# EAGLE design EURO_MIXER_2 (EAGLE 9.5.1)
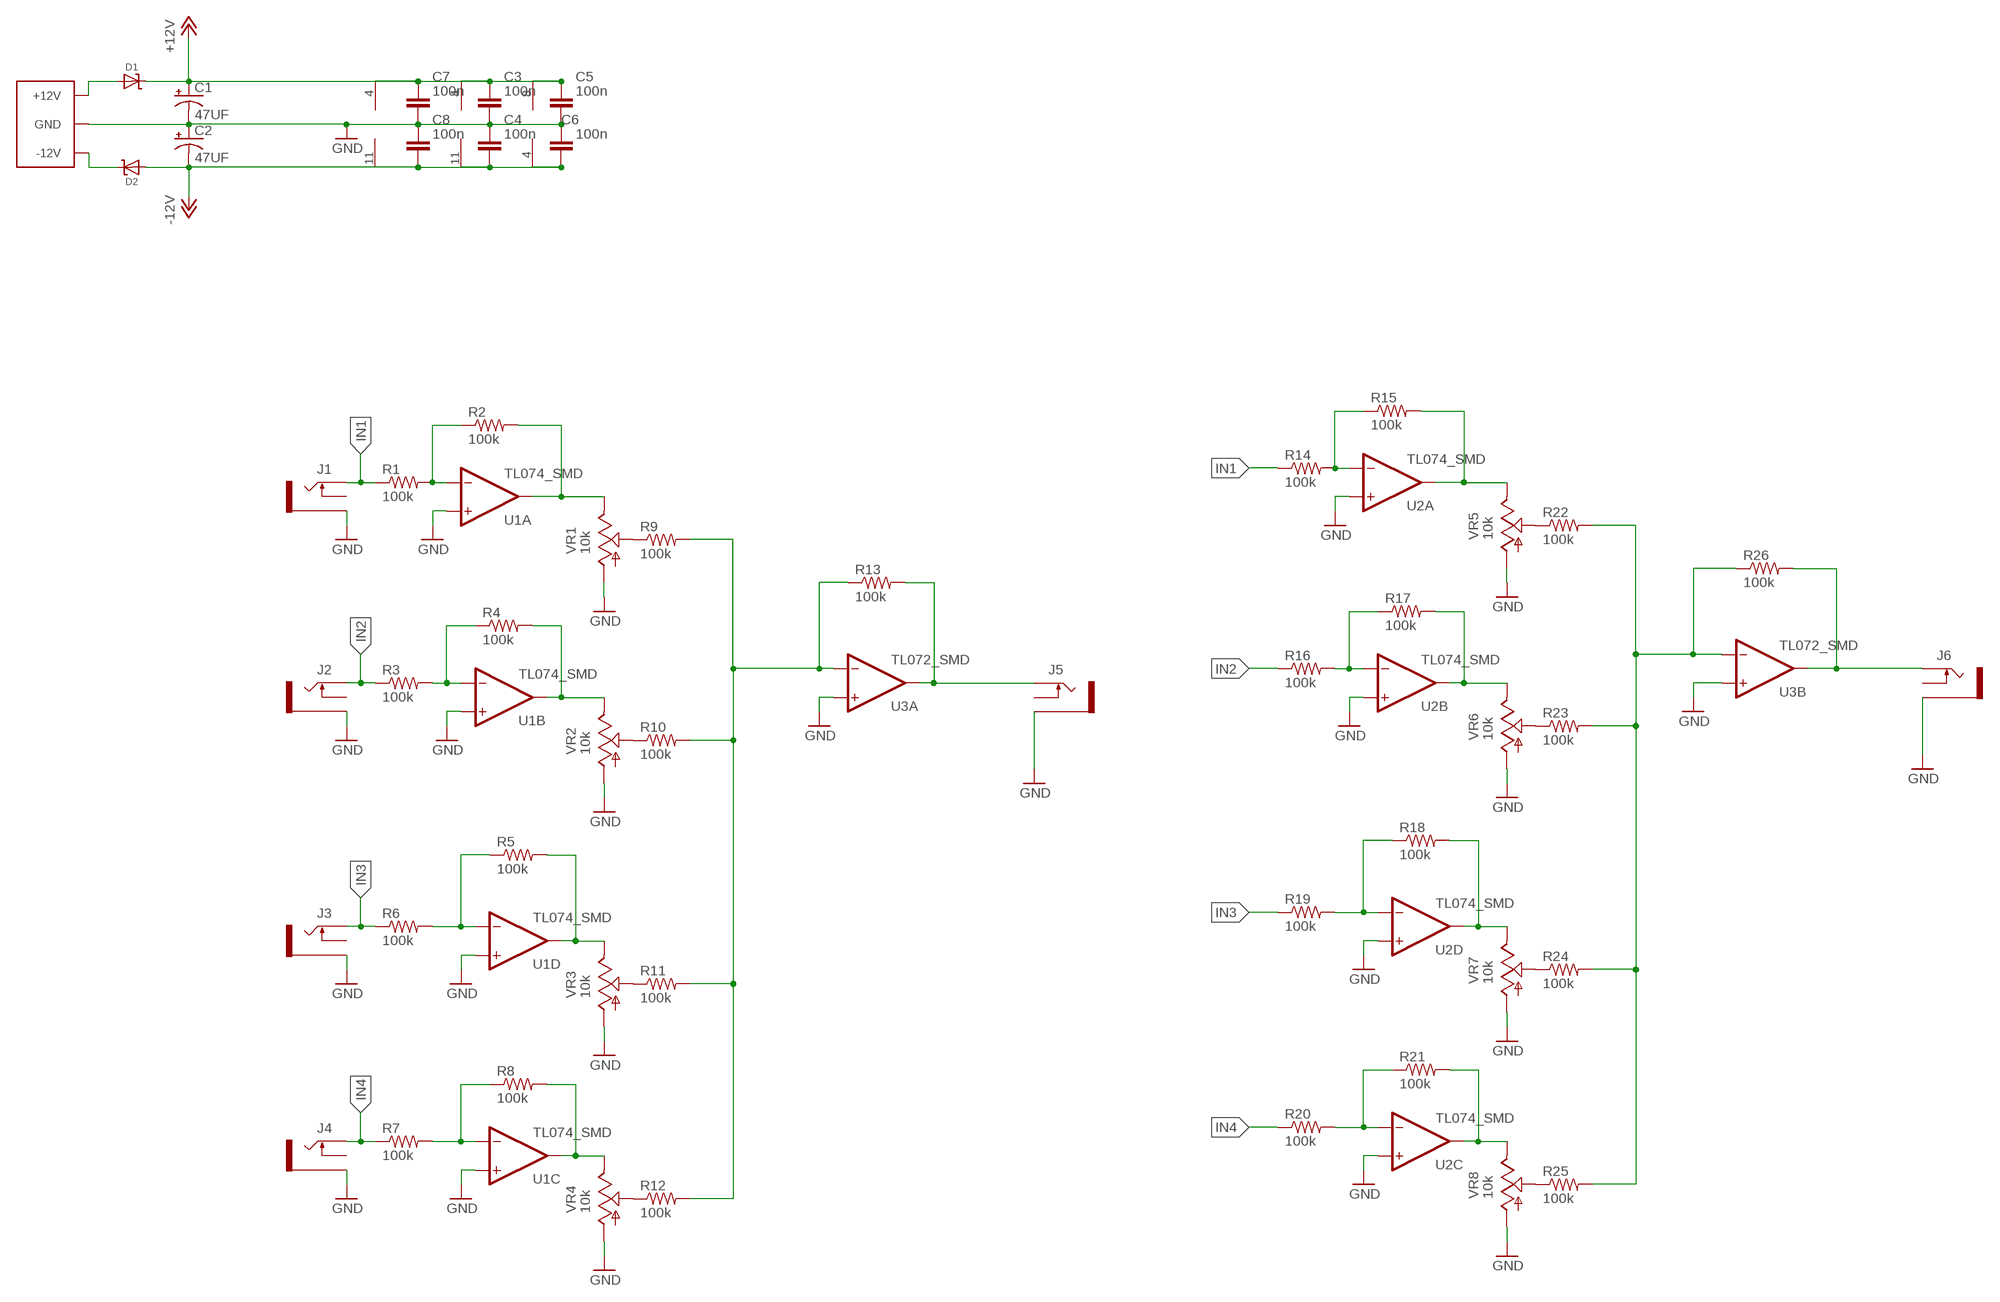
[diagram p0: schematic, sheet 1]

## Parts
C1  47UF  47UF-POLAR-PANASONIC_D-50V-20%  [PANASONIC_D]
C2  47UF  47UF-POLAR-PANASONIC_D-50V-20%  [PANASONIC_D]
C3  100n  C_CHIP-0805(2012-METRIC)  [CAPC2012X110]
C4  100n  C_CHIP-0805(2012-METRIC)  [CAPC2012X110]
C5  100n  C_CHIP-0805(2012-METRIC)  [CAPC2012X110]
C6  100n  C_CHIP-0805(2012-METRIC)  [CAPC2012X110]
C7  100n  C_CHIP-0805(2012-METRIC)  [CAPC2012X110]
C8  100n  C_CHIP-0805(2012-METRIC)  [CAPC2012X110]
D1  DIODE-SCHOTTKYSOD-123  [SOD-123]
D2  DIODE-SCHOTTKYSOD-123  [SOD-123]
J1  THONKICONNNEW  [WQP-PJ301M-12_JACK]
J2  THONKICONNNEW  [WQP-PJ301M-12_JACK]
J3  THONKICONNNEW  [WQP-PJ301M-12_JACK]
J4  THONKICONNNEW  [WQP-PJ301M-12_JACK]
J5  THONKICONNNEW  [WQP-PJ301M-12_JACK]
J6  THONKICONNNEW  [WQP-PJ301M-12_JACK]
JP1  EURO_POWER_LOCKSKINNY  [EURO_POWER_HEADER]
R1  100k  R-US_CHIP-0805(2012-METRIC)  [RESC2012X65]
R2  100k  R-US_CHIP-0805(2012-METRIC)  [RESC2012X65]
R3  100k  R-US_CHIP-0805(2012-METRIC)  [RESC2012X65]
R4  100k  R-US_CHIP-0805(2012-METRIC)  [RESC2012X65]
R5  100k  R-US_CHIP-0805(2012-METRIC)  [RESC2012X65]
R6  100k  R-US_CHIP-0805(2012-METRIC)  [RESC2012X65]
R7  100k  R-US_CHIP-0805(2012-METRIC)  [RESC2012X65]
R8  100k  R-US_CHIP-0805(2012-METRIC)  [RESC2012X65]
R9  100k  R-US_CHIP-0805(2012-METRIC)  [RESC2012X65]
R10  100k  R-US_CHIP-0805(2012-METRIC)  [RESC2012X65]
R11  100k  R-US_CHIP-0805(2012-METRIC)  [RESC2012X65]
R12  100k  R-US_CHIP-0805(2012-METRIC)  [RESC2012X65]
R13  100k  R-US_CHIP-0805(2012-METRIC)  [RESC2012X65]
R14  100k  R-US_CHIP-0805(2012-METRIC)  [RESC2012X65]
R15  100k  R-US_CHIP-0805(2012-METRIC)  [RESC2012X65]
R16  100k  R-US_CHIP-0805(2012-METRIC)  [RESC2012X65]
R17  100k  R-US_CHIP-0805(2012-METRIC)  [RESC2012X65]
R18  100k  R-US_CHIP-0805(2012-METRIC)  [RESC2012X65]
R19  100k  R-US_CHIP-0805(2012-METRIC)  [RESC2012X65]
R20  100k  R-US_CHIP-0805(2012-METRIC)  [RESC2012X65]
R21  100k  R-US_CHIP-0805(2012-METRIC)  [RESC2012X65]
R22  100k  R-US_CHIP-0805(2012-METRIC)  [RESC2012X65]
R23  100k  R-US_CHIP-0805(2012-METRIC)  [RESC2012X65]
R24  100k  R-US_CHIP-0805(2012-METRIC)  [RESC2012X65]
R25  100k  R-US_CHIP-0805(2012-METRIC)  [RESC2012X65]
R26  100k  R-US_CHIP-0805(2012-METRIC)  [RESC2012X65]
U1  TL074_SMD  [SO14]
U2  TL074_SMD  [SO14]
U3  TL072_SMD  [SO08]
VR1  10k  9MM_SNAP-IN_POT_  [9MM_SNAP-IN_POT]
VR2  10k  9MM_SNAP-IN_POT_  [9MM_SNAP-IN_POT]
VR3  10k  9MM_SNAP-IN_POT_  [9MM_SNAP-IN_POT]
VR4  10k  9MM_SNAP-IN_POT_  [9MM_SNAP-IN_POT]
VR5  10k  9MM_SNAP-IN_POT_  [9MM_SNAP-IN_POT]
VR6  10k  9MM_SNAP-IN_POT_  [9MM_SNAP-IN_POT]
VR7  10k  9MM_SNAP-IN_POT_  [9MM_SNAP-IN_POT]
VR8  10k  9MM_SNAP-IN_POT_  [9MM_SNAP-IN_POT]

## Nets
+12V: C1.+ C3.1 C5.1 C7.1 D1.C U1.4(P:V+) U2.4(P:V+) U3.8(P:V+)
-12V: C2.- C4.2 C6.2 C8.2 D2.A U1.11(P:V-) U2.11(P:V-) U3.4(P:V-)
GND: C1.- C2.+ C3.2 C4.1 C5.2 C6.1 C7.2 C8.1 J1.P$3_SLEEVE(SLEEVE) J2.P$3_SLEEVE(SLEEVE) J3.P$3_SLEEVE(SLEEVE) J4.P$3_SLEEVE(SLEEVE) J5.P$3_SLEEVE(SLEEVE) J6.P$3_SLEEVE(SLEEVE) JP1.3(GND) JP1.4(GND) JP1.5(GND) JP1.6(GND) JP1.7(GND) JP1.8(GND) U1.3(A:+IN) U1.5(B:+IN) U1.10(C:+IN) U1.12(D:+IN) U2.3(A:+IN) U2.5(B:+IN) U2.10(C:+IN) U2.12(D:+IN) U3.3(A:+IN) U3.5(B:+IN) VR1.1(A) VR2.1(A) VR3.1(A) VR4.1(A) VR5.1(A) VR6.1(A) VR7.1(A) VR8.1(A)
IN1: J1.P$1_TIP(TIP) R1.1 R14.1
IN2: J2.P$1_TIP(TIP) R3.1 R16.1
IN3: J3.P$1_TIP(TIP) R6.1 R19.1
IN4: J4.P$1_TIP(TIP) R7.1 R20.1
N$1: J6.P$1_TIP(TIP) R26.2 U3.7(B:OUT)
N$2: R1.2 R2.1 U1.2(A:-IN)
N$3: R2.2 U1.1(A:OUT) VR1.3(E)
N$4: D1.A JP1.9(+12V) JP1.10(+12V)
N$6: R7.2 R8.1 U1.9(C:-IN)
N$7: R4.2 U1.7(B:OUT) VR2.3(E)
N$8: R3.2 R4.1 U1.6(B:-IN)
N$10: R5.2 U1.14(D:OUT) VR3.3(E)
N$11: R14.2 R15.1 U2.2(A:-IN)
N$12: R9.1 VR1.2(S)
N$13: R8.2 U1.8(C:OUT) VR4.3(E)
N$14: R10.1 VR2.2(S)
N$15: R11.1 VR3.2(S)
N$16: R12.1 VR4.2(S)
N$17: R9.2 R10.2 R11.2 R12.2 R13.1 U3.2(A:-IN)
N$18: R5.1 R6.2 U1.13(D:-IN)
N$19: J5.P$1_TIP(TIP) R13.2 U3.1(A:OUT)
N$20: R15.2 U2.1(A:OUT) VR5.3(E)
N$21: R17.2 U2.7(B:OUT) VR6.3(E)
N$22: R18.2 U2.14(D:OUT) VR7.3(E)
N$23: R21.2 U2.8(C:OUT) VR8.3(E)
N$24: R22.1 VR5.2(S)
N$25: R23.1 VR6.2(S)
N$26: R24.1 VR7.2(S)
N$27: R25.1 VR8.2(S)
N$28: R22.2 R23.2 R24.2 R25.2 R26.1 U3.6(B:-IN)
N$29: R18.1 R19.2 U2.13(D:-IN)
N$30: R16.2 R17.1 U2.6(B:-IN)
N$31: R20.2 R21.1 U2.9(C:-IN)
N$32: D2.C JP1.1(-12V) JP1.2(-12V)
Unconnected: J1.P$2_SWITCH(SWITCH) J2.P$2_SWITCH(SWITCH) J3.P$2_SWITCH(SWITCH) J4.P$2_SWITCH(SWITCH) J5.P$2_SWITCH(SWITCH) J6.P$2_SWITCH(SWITCH)

## Library data of the parts
C1 C2 = SparkFun-Capacitors:47UF-POLAR: 47µF polarized capacitors A capacitor is a passive two-terminal electrical component used to store electrical energy temporarily in an electric field.
C3-C8 = Capacitor:C: Capacitor - Generic; CATEGORY: Capacitor
D1 D2 = Airquality_Sensor:DIODE-SCHOTTKY
J1-J6 = MusicThingModular:THONKICONN: 3.5mm socket for Eurorack modular synths
JP1 = MusicThingModular:EURO_POWER_LOCK
R1-R26 = Resistor:R-US: Resistor Fixed - ANSI; CATEGORY: Resistor; SUB-CATEGORY: Fixed
U1 U2 = MusicThingModular:TL074: Generic Quad Op Amp
U3 = MusicThingModular:TL072: Generic Dual Op Amp
VR1-VR8 = MusicThingModular:9MM_SNAP-IN_POT: 9mm vertical snap-in pot, Alpha / Panasonic style

## Net classes
0 default: width 0.305 mm, drill 0.508 mm, clearance 0.254 mm

## Board
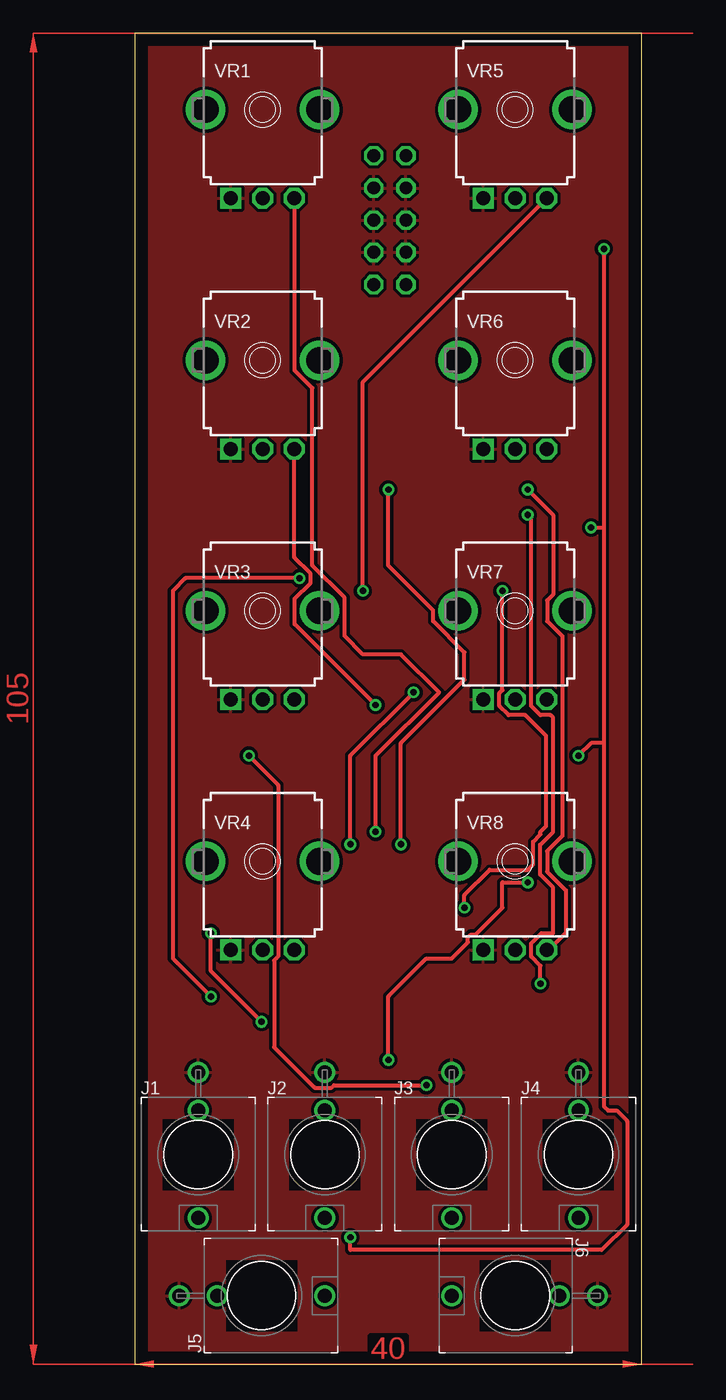
[diagram p1: board, top side]
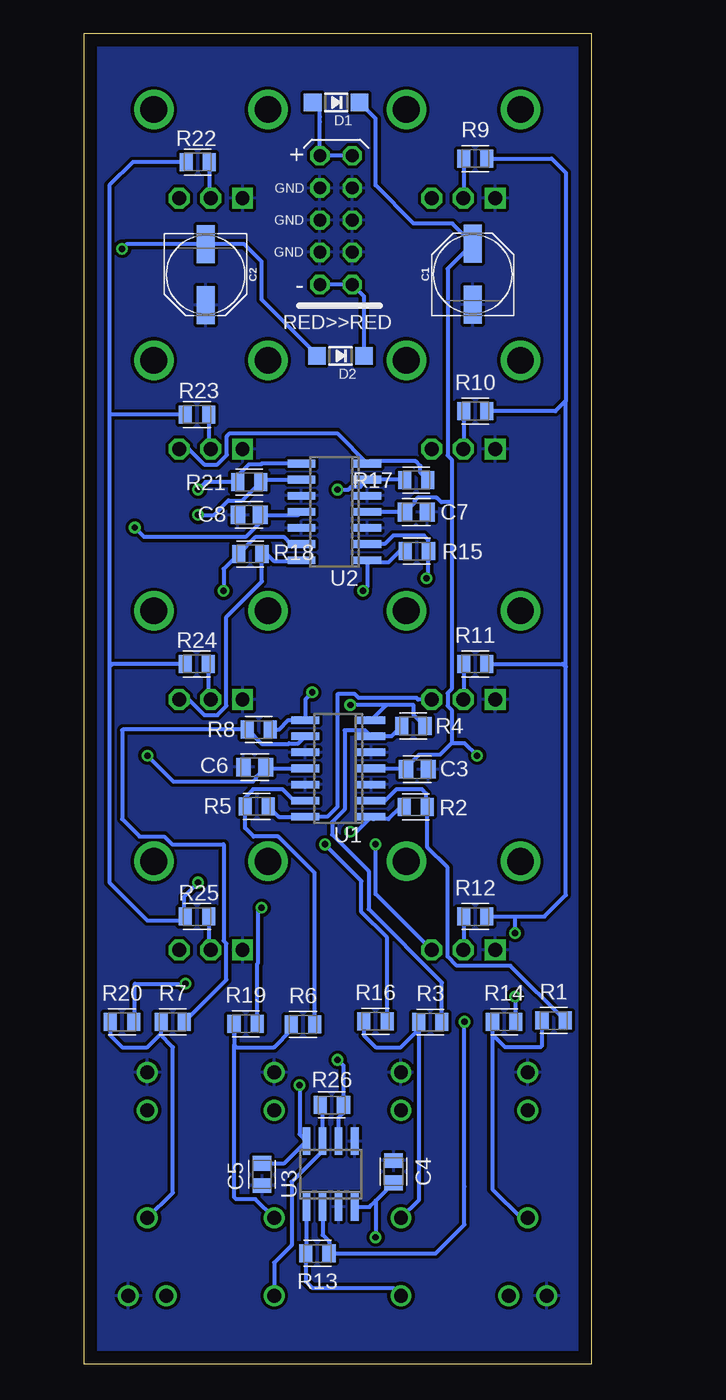
[diagram p2: board, bottom side, seen from below]

Size 40 x 105 mm. Coordinates in mm from the lower left corner, seen from the top.
Outline: 0,0 40,0 40,105 0,105 0,0
Copper layers (1*16): Top 0.035mm / dielectric 1.5mm / Bottom 0.035mm
Design rules "default": minimum track width 6mil, minimum drill 0.35mm, track to track 6mil, track to pad 6mil, pad to pad 6mil, via to via 6mil, smd to smd 6mil, copper to edge 40mil, drill to drill 6mil, minimum pad ring 10mil, minimum via ring 8mil, stop-mask expansion 4mil, vias tented up to drill 0mil, thermal gap 10mil

### Footprints (pad centres in the part's own frame; a part is rotated, then mirrored left to right if it is on the bottom)
PANASONIC_D = smd 3 x 1.4: + 2.4,0; - -2.4,0
CAPC2012X110 = smd 1.165 x 1.465: 1 -0.875,0; 2 0.875,0
SOD-123 = smd 1.4 x 1.4: A 1.85,0; C -1.85,0
WQP-PJ301M-12_JACK = drill 1.1: P$1_TIP 0,5; P$2_SWITCH 0,-3.5; P$3_SLEEVE 0,-6.5
EURO_POWER_HEADER = drill 1.016 octagon: 1 -5.08,-1.27; 2 -5.08,1.27; 3 -2.54,-1.27; 4 -2.54,1.27; 5 0,-1.27; 6 0,1.27; 7 2.54,-1.27; 8 2.54,1.27; 9 5.08,-1.27; 10 5.08,1.27
RESC2012X65 = smd 1.031 x 1.42: 1 -0.919,0; 2 0.919,0
SO14 = smd 0.6 x 2.2: 1 -3.81,-2.6; 2 -2.54,-2.6; 3 -1.27,-2.6; 4 0,-2.6; 5 1.27,-2.6; 6 2.54,-2.6; 7 3.81,-2.6; 8 3.81,2.6; 9 2.54,2.6; 10 1.27,2.6; 11 0,2.6; 12 -1.27,2.6; 13 -2.54,2.6; 14 -3.81,2.6
SO08 = smd 0.6 x 2.2: 1 -1.905,-2.6; 2 -0.635,-2.6; 3 0.635,-2.6; 4 1.905,-2.6; 5 1.905,2.6; 6 0.635,2.6; 7 -0.635,2.6; 8 -1.905,2.6
9MM_SNAP-IN_POT = drill 1.1 square: 1 -2.5,-7 | drill 1.1 octagon: 2 0,-7; 3 2.5,-7 | drill 2.1 pad 2.794: CHASSIS1 -4.5,0; CHASSIS2 4.5,0

### Placement (x,y rotation side)
C1  9.34,85.99 90 bottom
C2  30.41,85.96 270 bottom
C3  13.72,46.93 0 bottom
C4  15.58,15.18 270 bottom
C5  25.95,14.96 270 bottom
C6  26.55,47.1 0 bottom
C7  13.81,67.22 0 bottom
C8  26.98,67 0 bottom
D1  20.12,99.55 180 bottom
D2  19.77,79.55 180 bottom
J1  5,16.52 180 top
J2  15,16.52 180 top
J3  25,16.52 180 top
J4  35,16.52 180 top
J5  10,5.4 270 top
J6  30,5.4 90 top
JP1  20.12,90.26 90 bottom
R1  2.96,27.1 0 bottom
R2  13.84,43.97 180 bottom
R3  12.69,26.98 0 bottom
R4  14.03,50.34 0 bottom
R5  26.38,44.01 0 bottom
R6  22.73,26.8 0 bottom
R7  33,27 0 bottom
R8  26.22,50.06 0 bottom
R9  9.14,95.12 0 bottom
R10  9.14,75.18 0 bottom
R11  9.14,55.24 0 bottom
R12  9.14,35.31 0 bottom
R13  21.6,8.72 180 bottom
R14  6.87,27.01 0 bottom
R15  13.75,64.14 180 bottom
R16  17.02,27.05 0 bottom
R17  13.8,69.75 0 bottom
R18  26.89,63.93 0 bottom
R19  27.25,26.85 0 bottom
R20  37,27 0 bottom
R21  26.97,69.59 180 bottom
R22  31.04,94.84 180 bottom
R23  31.08,74.93 180 bottom
R24  31.11,55.24 180 bottom
R25  31.08,35.31 180 bottom
R26  20.45,20.44 180 bottom
U1  19.95,46.99 90 bottom
U2  20.25,67.24 90 bottom
U3  20.55,14.99 0 bottom
VR1  10.08,98.98 0 top
VR2  10.08,79.21 0 top
VR3  10.08,59.43 0 top
VR4  10.08,39.66 0 top
VR5  30,98.98 0 top
VR6  30,79.21 0 top
VR7  30,59.43 0 top
VR8  30,39.66 0 top

### Tracks (layer width: path | path; a pad name or v marks a point on that pad's centre or on a via)
+12V  (via drill 0.51)
  Top 0.305: v9,48 11.31,45.69 11.31,32.15 11,31.84 11,25 14.21,21.79 15.51,21.79 15.72,22 v23,22
  Bottom 0.305: D1.C 17,98.28 17,93 14,90 10.95,90 C1.+ 11.31,86.42 11.31,71.7 11,71.39 11,68 | C5.1 24.21,15.84 U3.8 23,18.14 v23,22 | U1.4 14.54,46.99 C3.1 14.6,47.07 13.6,48.07 11.93,48.07 11,49 | U2.4 17.63,67.22 C7.1 13.92,67.98 13.92,68.12 13.69,68.36 12.19,68.36 11.82,68 11,68 | 11,68 11,53.26 11.31,52.94 11.31,51.92 11,51.61 11,49 | 11,49 10,49 v9,48
-12V  (via drill 0.51)
  Top 0.305: v37,88 37,66 | 37,66 37,49 | 37,49 37,20.34 37.34,20 38,20 38.83,19.17 38.83,11 36.83,9 17,9 v17,10 | v36,66 37,66 | 37,49 36,49 v35,48
  Bottom 0.305: D2.A 21.62,79.62 26,84 26,87 27.36,88.36 C2.- 36.64,88.36 v37,88 | U3.4 17.5,12.39 17,12.89 | 17,12.89 C4.2 | U1.11 25.57,47 C6.2 26.44,46.34 26.44,46.2 26.68,45.96 32.96,45.96 v35,48 | U2.11 23.09,67 C8.2 26.11,66.41 27.26,65.26 35.26,65.26 v36,66 | 17,12.89 v17,10
GND
  pour Bottom: -4,111 43,111 43,-3 -5,-3 -5,111
  pour Top: -5,-3 43,-3 43,111 -5,111
IN1
  Bottom 0.305: R14.1 7.79,26 | 7.79,26 7.79,13.78 5.52,11.52 J1.P$1_TIP | R1.1 3.88,25.12 4,25 6.79,25 7.79,26
IN2
  Bottom 0.305: R16.1 17.94,25.94 17,25 15,25 13.61,26.39 R3.1 13.61,12.91 J2.P$1_TIP
IN3
  Bottom 0.305: R19.1 28.17,26 28.17,25.17 | 28.17,25.17 28,25 25,25 23.65,26.35 R6.1 | J3.P$1_TIP 26.48,13 28,13 28.17,13.17 28.17,25.17
IN4
  Bottom 0.305: R20.1 37.92,25.92 37,25 35,25 34,26 | 34,26 33.92,26.08 R7.1 | J4.P$1_TIP 33,13.52 33,25 34,26
N$1
  Bottom 0.305: R26.2 21.18,20.25 U3.7 21.18,16.82 23.62,14.38 23.62,9.38 25,8 J6.P$1_TIP
N$2
  Bottom 0.305: U1.2 16.26,44.45 15.37,45.34 13.34,45.34 13,45 13,44.05 R2.1 12.92,40.78 11.31,39.17 11.31,32.15 10.59,31.43 6.37,31.43 R1.2
N$3  (via drill 0.51)
  Top 0.305: v19,42 19,48 24,53 21,56 18,56 16.55,57.45 16.55,60.47 14,63.01 14,77.01 12.62,78.39 12.62,91.94 VR1.3
  Bottom 0.305: R2.2 15.03,43.97 16,43 17.17,43 U1.1 18.53,42 v19,42
N$4
  Bottom 0.305: JP1.9 JP1.10 21.39,98 21.39,98.39 21.39,98.97 D1.A
N$6
  Bottom 0.305: U1.9 23.11,48.97 23.82,48.97 23.84,48.94 25.98,48.94 27.1,50.06 R8.1 36.94,50.06 37,50 37,43 35.62,41.62 33.69,41.62 33.06,41 29,41 29,33.4 28.77,33.17 28.77,30.31 R7.2
N$7  (via drill 0.51)
  Top 0.305: VR2.3 12.58,63.64 13.86,62.36 13.86,61.64 12.62,60.4 12.62,58.38 v19,52
  Bottom 0.305: R4.2 14,51.23 14,52 16.15,52 | 16.15,52 U1.7 | 16.15,52 v19,52
N$8
  Bottom 0.305: R4.1 15.75,49.53 U1.6 17.82,50 19.44,50 19.44,43.77 20.44,42.77 20.44,41.78 17.56,38.9 17.56,35.9 11.77,30.11 R3.2
N$10
  Bottom 0.305: R5.2 24.63,43.18 U1.14 20.82,43.18 20,44 20,52.86 18.64,52.86 18.34,52.56 13.77,52.56 13.64,52.43 VR3.3
N$11  (via drill 0.51)
  Top 0.305: v13,62 4,62 3,61 3,32 v6,29
  Bottom 0.305: U2.2 16.3,64.7 15.61,65.39 13.19,65.39 12.83,65.03 R15.1 12.83,62.17 v13,62 | v6,29 6,27.07 R14.2
N$12
  Bottom 0.305: R9.1 10.06,92 VR1.2
N$13  (via drill 0.51)
  Top 0.305: v17,41 17,48 v22,53
  Bottom 0.305: R8.2 24.62,50.06 23.88,50.8 U1.8 22.55,52.45 v22,53 | VR4.3 17,37.08 v17,41
N$14
  Bottom 0.305: R10.1 10.06,72.22 VR2.2
N$15
  Bottom 0.305: R11.1 10.06,52.45 VR3.2
N$16
  Bottom 0.305: R12.1 10.06,32.68 VR4.2
N$17  (via drill 0.51)
  Top 0.305: v10,27 6,31 v6,34
  Bottom 0.305: U3.2 21.18,10.19 20.68,9.68 R13.1 12.28,8.72 10,11 10,14 | R9.2 3.12,95.12 2,94 2,76 | 2,76 2.82,75.18 R10.2 | R12.2 6,35.31 | 6,35.31 3.69,35.31 2,37 2,55 | 2,55 2,76 | R11.2 2.25,55.24 2,55 | 10,14 v10,27 | v6,34 6,35.31 | 10,14
N$18
  Bottom 0.305: U1.13 23.45,44.45 24.34,45.34 26.66,45.34 27.3,44.7 R5.1 27.3,42.3 26.62,41.62 24.69,41.62 21.81,38.75 R6.2
N$19
  Bottom 0.305: U3.1 22.45,8.78 R13.2 22.52,6.52 22,6 15.6,6 J5.P$1_TIP
N$20  (via drill 0.51)
  Top 0.305: v18,61 18,77.48 VR5.3
  Bottom 0.305: R15.2 15.11,64.14 16,63.25 17.46,63.25 U2.1 17.65,61.35 v18,61
N$21
  Bottom 0.305: R17.2 13.46,70.34 13.46,70.87 13.84,71.25 17.46,71.25 U2.7 20.04,73.44 28.49,73.44 28.73,73.2 28.73,71.73 29.49,70.98 30.51,70.98 31.74,72.21 VR6.3
N$22
  Bottom 0.305: U2.14 22.91,63.37 25.02,63.37 25.57,63.93 R18.2 25.96,61.75 28.77,58.94 28.77,51.92 29.49,51.2 30.51,51.2 31.74,52.43 VR7.3
N$23  (via drill 0.51)
  Top 0.305: v31,69 33,67 33,60.71 32.54,60.25 32.54,58.62 33.73,57.42 33.73,41.67 32.54,40.47 32.54,38.85 34,37.38 34,34 32.66,32.66 VR8.3
  Bottom 0.305: U2.8 25.95,71.05 26.02,70.98 27,70.98 27.89,70.08 R21.2 30.41,69.59 v31,69
N$24
  Bottom 0.305: R22.1 30.12,92.1 VR5.2
N$25
  Bottom 0.305: R23.1 30.16,72.37 VR6.2
N$26
  Bottom 0.305: R24.1 30.2,52.63 VR7.2
N$27
  Bottom 0.305: R25.1 30.16,32.82 VR8.2
N$28  (via drill 0.51)
  Top 0.305: v20,24 20,29 23,32 25,32 26.27,33.27 26.27,33.65 26.51,33.89 26.89,33.89 29,36 29,38 v31,38
  Bottom 0.305: U3.6 19.91,19.45 19.43,19.94 19.43,20.34 R26.1 19.54,23.54 v20,24 | R22.2 36.16,94.84 38,93 38,75 | 38,75 38,55 | 38,55 38,38 35,35 32.31,35 32.15,35.15 | 32.15,35.15 R25.2 | R24.2 37.76,55.24 38,55 | R23.2 37.93,74.93 38,75 | v31,38 32.15,36.85 32.15,35.15
N$29  (via drill 0.51)
  Top 0.305: v26,36 26,37 28,39 31,39 31.42,39.42 31.42,41.21 32,41.79 32,42 32.44,42.44 32.44,49.56 30.8,51.2 29.49,51.2 28.77,51.92 28.77,52.94 29,53.17 v29,61
  Bottom 0.305: U2.13 23.68,64.7 24.26,65.28 26.45,65.28 R18.1 29,62.73 v29,61 | R19.2 26.33,31.6 26.27,31.67 26.27,35.73 v26,36
N$30  (via drill 0.51)
  Top 0.305: v21,41 21,49 26,54 26,56.16 23.54,58.62 23.54,59.46 20,63 v20,69
  Bottom 0.305: R17.1 14.75,69.78 U2.6 18.21,69.22 18.92,69.22 19.14,69 v20,69 | R16.2 16.1,33.65 18.12,35.66 18.12,38.12 v21,41
N$31  (via drill 0.51)
  Top 0.305: v32,30 32,31.42 31.27,32.15 31.27,33.17 32.1,34 33,34 33,37.59 31.98,38.62 31.98,40.98 33,42 33,51 32.8,51.2 31.99,51.2 31.27,51.92 31.27,66.73 v31,67
  Bottom 0.305: U2.9 25.86,69.78 R21.1 27.51,68.14 28.61,68.14 29.75,67 v31,67 | R20.2 36,27.08 36,30 v32,30
N$32
  Bottom 0.305: D2.C 17.92,84.25 JP1.1 JP1.2
(copper drawn outside any net)
  shapes: Top area x3